# Altium project Time4CM4_Modular_v2.PrjPcb (part 2 of 2)
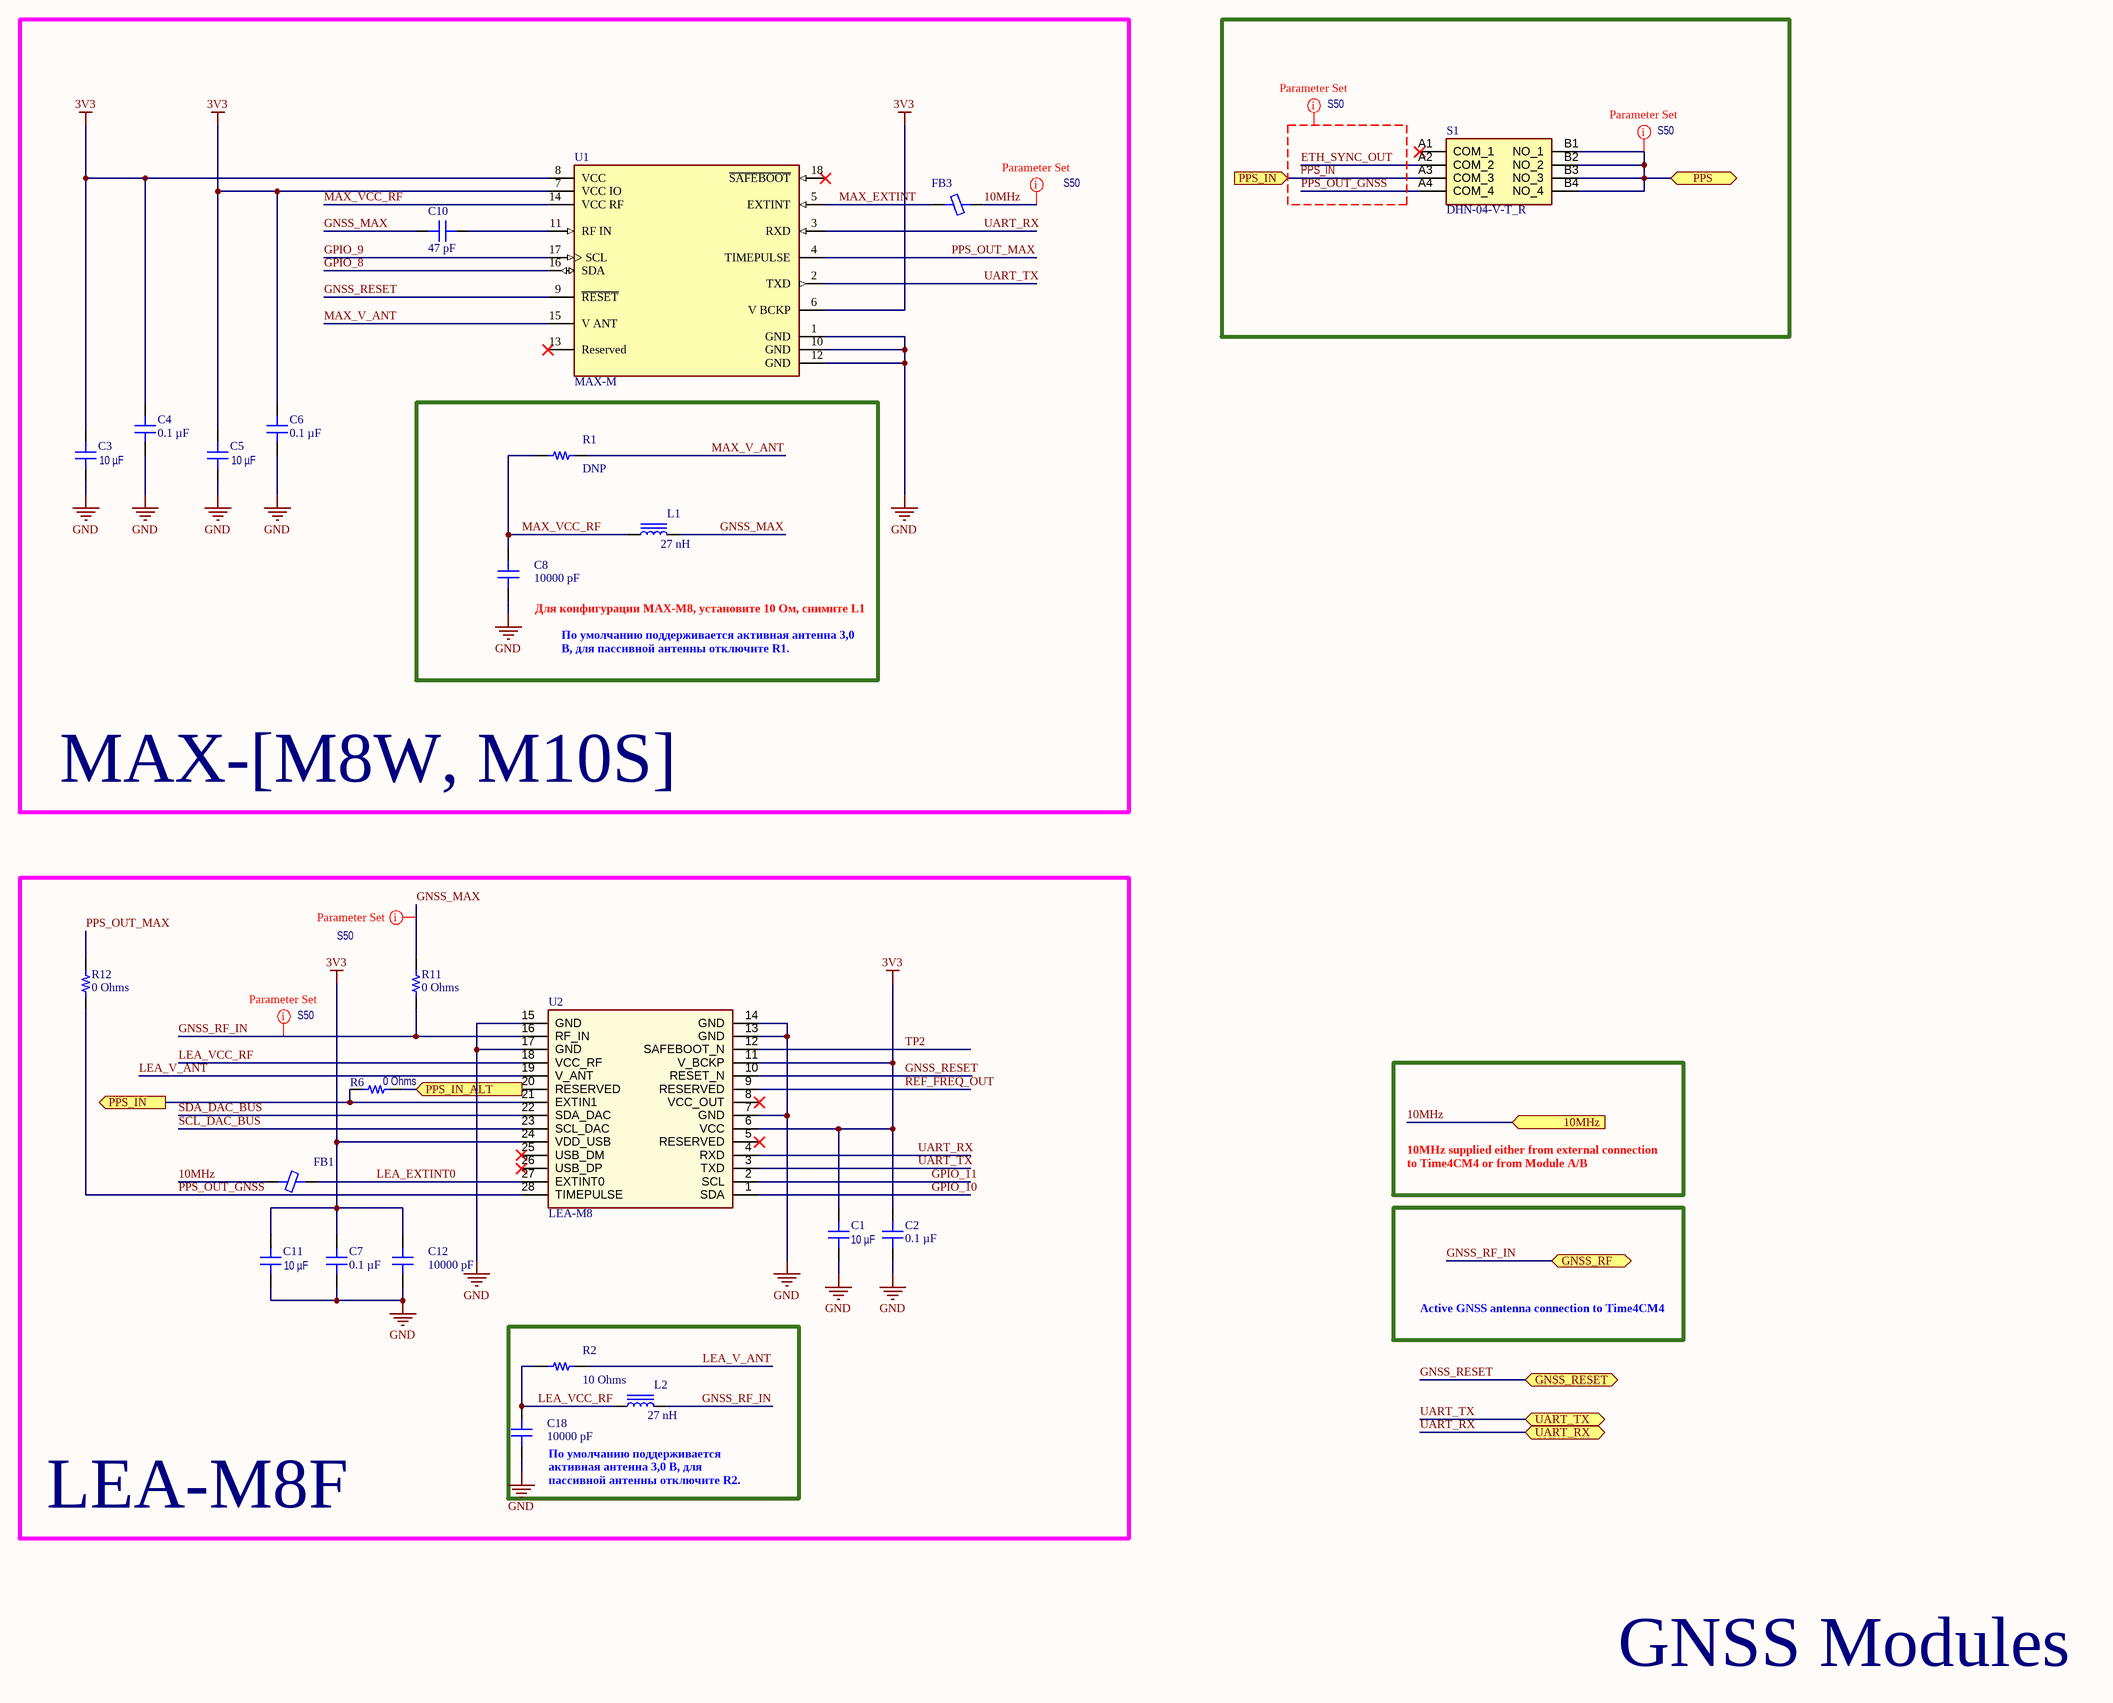
[diagram p6: GNSS.SchDoc]

## Nets that join several sheets
1V8: CM4_Conn (CM4.88 CM4.90), CM4_IO_Conn (CM1.88 CM1.90)
3V3: CM4_Conn (CM4.84 CM4.86), CM4_IO_Conn (CM1.84 CM1.86), Modular_BO (6 pins), GNSS (15 pins)
5V: CM4_Conn (6 pins), CM4_IO_Conn (6 pins), Modular_BO (C14.2 IC2.4 IC2.6)
GND: CM4_Conn (50 pins), CM4_IO_Conn (50 pins), Modular_BO (24 pins), GNSS (19 pins)
10MHz: Modular_BO (J2.1 J4.1 R10.1), GNSS (FB1.1 FB3.1)
ANAIP_0: CM4_Conn (CM4.96), CM4_IO_Conn (CM1.96)
ANAIP_1: CM4_Conn (CM4.94), CM4_IO_Conn (CM1.94)
BT_DIS: CM4_Conn (CM4.91), CM4_IO_Conn (CM1.91)
CM0_C_N: CM4_Conn (CM4.140), CM4_IO_Conn (CM1.140)
CM0_C_P: CM4_Conn (CM4.142), CM4_IO_Conn (CM1.142)
CM0_D0_N: CM4_Conn (CM4.128), CM4_IO_Conn (CM1.128)
CM0_D0_P: CM4_Conn (CM4.130), CM4_IO_Conn (CM1.130)
CM0_D1_N: CM4_Conn (CM4.134), CM4_IO_Conn (CM1.134)
CM0_D1_P: CM4_Conn (CM4.136), CM4_IO_Conn (CM1.136)
CM1_C_N: CM4_Conn (CM4.127), CM4_IO_Conn (CM1.127)
CM1_C_P: CM4_Conn (CM4.129), CM4_IO_Conn (CM1.129)
CM1_D0_N: CM4_Conn (CM4.115), CM4_IO_Conn (CM1.115)
CM1_D0_P: CM4_Conn (CM4.117), CM4_IO_Conn (CM1.117)
CM1_D1_N: CM4_Conn (CM4.121), CM4_IO_Conn (CM1.121)
CM1_D1_P: CM4_Conn (CM4.123), CM4_IO_Conn (CM1.123)
CM1_D2_N: CM4_Conn (CM4.133), CM4_IO_Conn (CM1.133)
CM1_D2_P: CM4_Conn (CM4.135), CM4_IO_Conn (CM1.135)
CM1_D3_N: CM4_Conn (CM4.139), CM4_IO_Conn (CM1.139)
CM1_D3_P: CM4_Conn (CM4.141), CM4_IO_Conn (CM1.141)
CM_GPIOx: CM4_Conn (CM4.97), CM4_IO_Conn (CM1.97)
DSI0_C_N: CM4_Conn (CM4.169), CM4_IO_Conn (CM1.169)
DSI0_C_P: CM4_Conn (CM4.171), CM4_IO_Conn (CM1.171)
DSI0_D0_N: CM4_Conn (CM4.157), CM4_IO_Conn (CM1.157)
DSI0_D0_P: CM4_Conn (CM4.159), CM4_IO_Conn (CM1.159)
DSI0_D1_N: CM4_Conn (CM4.163), CM4_IO_Conn (CM1.163)
DSI0_D1_P: CM4_Conn (CM4.165), CM4_IO_Conn (CM1.165)
DSI1_C_N: CM4_Conn (CM4.187), CM4_IO_Conn (CM1.187)
DSI1_C_P: CM4_Conn (CM4.189), CM4_IO_Conn (CM1.189)
DSI1_D0_N: CM4_Conn (CM4.175), CM4_IO_Conn (CM1.175)
DSI1_D0_P: CM4_Conn (CM4.177), CM4_IO_Conn (CM1.177)
DSI1_D1_N: CM4_Conn (CM4.181), CM4_IO_Conn (CM1.181)
DSI1_D1_P: CM4_Conn (CM4.183), CM4_IO_Conn (CM1.183)
DSI1_D2_N: CM4_Conn (CM4.193), CM4_IO_Conn (CM1.193)
DSI1_D2_P: CM4_Conn (CM4.195), CM4_IO_Conn (CM1.195)
DSI1_D3_N: CM4_Conn (CM4.194), CM4_IO_Conn (CM1.194)
DSI1_D3_P: CM4_Conn (CM4.196), CM4_IO_Conn (CM1.196)
EEPROM_WP: CM4_Conn (CM4.20), CM4_IO_Conn (CM1.20)
ETH_LED1: CM4_Conn (CM4.19), CM4_IO_Conn (CM1.19)
ETH_LED2: CM4_Conn (CM4.17), CM4_IO_Conn (CM1.17)
ETH_LED3: CM4_Conn (CM4.15), CM4_IO_Conn (CM1.15)
ETH_PAIR0_N: CM4_Conn (CM4.10), CM4_IO_Conn (CM1.10)
ETH_PAIR0_P: CM4_Conn (CM4.12), CM4_IO_Conn (CM1.12)
ETH_PAIR1_N: CM4_Conn (CM4.6), CM4_IO_Conn (CM1.6)
ETH_PAIR1_P: CM4_Conn (CM4.4), CM4_IO_Conn (CM1.4)
ETH_PAIR2_N: CM4_Conn (CM4.9), CM4_IO_Conn (CM1.9)
ETH_PAIR2_P: CM4_Conn (CM4.11), CM4_IO_Conn (CM1.11)
ETH_PAIR3_N: CM4_Conn (CM4.5), CM4_IO_Conn (CM1.5)
ETH_PAIR3_P: CM4_Conn (CM4.3), CM4_IO_Conn (CM1.3)
ETH_SYNC_IN: CM4_Conn (CM4.16), CM4_IO_Conn (CM1.16)
ETH_SYNC_OUT: CM4_Conn (CM4.18), CM4_IO_Conn (CM1.18), GNSS (S1.A2)
GLOBAL_EN: CM4_Conn (CM4.99), CM4_IO_Conn (CM1.99)
GNSS_RESET: CM4_Conn (CM4.25), CM4_IO_Conn (CM1.25), GNSS (U1.9 U2.10)
GNSS_RF_IN: Modular_BO (J1.1), GNSS (L2.2 R11.1 U2.16)
GPIO_0: CM4_Conn (CM4.36), CM4_IO_Conn (CM1.36), Modular_BO (Y1.2 Y2.2)
GPIO_1: CM4_Conn (CM4.35), CM4_IO_Conn (CM1.35), Modular_BO (Y1.3 Y2.3)
GPIO_2: CM4_Conn (CM4.58), CM4_IO_Conn (CM1.58)
GPIO_3: CM4_Conn (CM4.56), CM4_IO_Conn (CM1.56)
GPIO_4: CM4_Conn (CM4.54), CM4_IO_Conn (CM1.54)
GPIO_5: CM4_Conn (CM4.34), CM4_IO_Conn (CM1.34)
GPIO_6: CM4_Conn (CM4.30), CM4_IO_Conn (CM1.30)
GPIO_7: CM4_Conn (CM4.37), CM4_IO_Conn (CM1.37)
GPIO_8: CM4_Conn (CM4.39), CM4_IO_Conn (CM1.39), GNSS (U1.16)
GPIO_9: CM4_Conn (CM4.40), CM4_IO_Conn (CM1.40), GNSS (U1.17)
GPIO_10: CM4_Conn (CM4.44), CM4_IO_Conn (CM1.44), GNSS (U2.1)
GPIO_11: CM4_Conn (CM4.38), CM4_IO_Conn (CM1.38), GNSS (U2.2)
GPIO_12: CM4_Conn (CM4.31), CM4_IO_Conn (CM1.31)
GPIO_13: CM4_Conn (CM4.28), CM4_IO_Conn (CM1.28)
GPIO_16: CM4_Conn (CM4.29), CM4_IO_Conn (CM1.29)
GPIO_17: CM4_Conn (CM4.50), CM4_IO_Conn (CM1.50)
GPIO_18: CM4_Conn (CM4.49), CM4_IO_Conn (CM1.49)
GPIO_19: CM4_Conn (CM4.26), CM4_IO_Conn (CM1.26)
GPIO_20: CM4_Conn (CM4.27), CM4_IO_Conn (CM1.27)
GPIO_22: CM4_Conn (CM4.46), CM4_IO_Conn (CM1.46)
GPIO_23: CM4_Conn (CM4.47), CM4_IO_Conn (CM1.47)
GPIO_24: CM4_Conn (CM4.45), CM4_IO_Conn (CM1.45)
GPIO_25: CM4_Conn (CM4.41), CM4_IO_Conn (CM1.41)
GPIO_26: CM4_Conn (CM4.24), CM4_IO_Conn (CM1.24)
GPIO_27: CM4_Conn (CM4.48), CM4_IO_Conn (CM1.48)
GPIO_44: CM4_Conn (CM4.82), CM4_IO_Conn (CM1.82)
GPIO_45: CM4_Conn (CM4.80), CM4_IO_Conn (CM1.80)
GPIO_VREF: CM4_Conn (CM4.78), CM4_IO_Conn (CM1.78)
HDMI0_CEC: CM4_Conn (CM4.151), CM4_IO_Conn (CM1.151)
HDMI0_CLK_N: CM4_Conn (CM4.190), CM4_IO_Conn (CM1.190)
HDMI0_CLK_P: CM4_Conn (CM4.188), CM4_IO_Conn (CM1.188)
HDMI0_HP: CM4_Conn (CM4.153), CM4_IO_Conn (CM1.153)
HDMI0_SCL: CM4_Conn (CM4.200), CM4_IO_Conn (CM1.200)
HDMI0_SDA: CM4_Conn (CM4.199), CM4_IO_Conn (CM1.199)
HDMI0_TX0_N: CM4_Conn (CM4.184), CM4_IO_Conn (CM1.184)
HDMI0_TX0_P: CM4_Conn (CM4.182), CM4_IO_Conn (CM1.182)
HDMI0_TX1_N: CM4_Conn (CM4.178), CM4_IO_Conn (CM1.178)
HDMI0_TX1_P: CM4_Conn (CM4.176), CM4_IO_Conn (CM1.176)
HDMI0_TX2_N: CM4_Conn (CM4.172), CM4_IO_Conn (CM1.172)
HDMI0_TX2_P: CM4_Conn (CM4.170), CM4_IO_Conn (CM1.170)
HDMI1_CEC: CM4_Conn (CM4.149), CM4_IO_Conn (CM1.149)
HDMI1_CLK_N: CM4_Conn (CM4.166), CM4_IO_Conn (CM1.166)
HDMI1_CLK_P: CM4_Conn (CM4.164), CM4_IO_Conn (CM1.164)
HDMI1_HP: CM4_Conn (CM4.143), CM4_IO_Conn (CM1.143)
HDMI1_SCL: CM4_Conn (CM4.147), CM4_IO_Conn (CM1.147)
HDMI1_SDA: CM4_Conn (CM4.145), CM4_IO_Conn (CM1.145)
HDMI1_TX0_N: CM4_Conn (CM4.160), CM4_IO_Conn (CM1.160)
HDMI1_TX0_P: CM4_Conn (CM4.158), CM4_IO_Conn (CM1.158)
HDMI1_TX1_N: CM4_Conn (CM4.154), CM4_IO_Conn (CM1.154)
HDMI1_TX1_P: CM4_Conn (CM4.152), CM4_IO_Conn (CM1.152)
HDMI1_TX2_N: CM4_Conn (CM4.148), CM4_IO_Conn (CM1.148)
HDMI1_TX2_P: CM4_Conn (CM4.146), CM4_IO_Conn (CM1.146)
LED_ACT: CM4_Conn (CM4.21), CM4_IO_Conn (CM1.21)
LED_PWR: CM4_Conn (CM4.95), CM4_IO_Conn (CM1.95)
nEXTRST: CM4_Conn (CM4.100), CM4_IO_Conn (CM1.100)
nRPIBOOT: CM4_Conn (CM4.93), CM4_IO_Conn (CM1.93)
PCIe_CLK_N: CM4_Conn (CM4.112), CM4_IO_Conn (CM1.112)
PCIe_CLK_nREQ: CM4_Conn (CM4.102), CM4_IO_Conn (CM1.102)
PCIe_CLK_P: CM4_Conn (CM4.110), CM4_IO_Conn (CM1.110)
PCIe_nRST: CM4_Conn (CM4.109), CM4_IO_Conn (CM1.109)
PCIe_RX_N: CM4_Conn (CM4.118), CM4_IO_Conn (CM1.118)
PCIe_RX_P: CM4_Conn (CM4.116), CM4_IO_Conn (CM1.116)
PCIe_TX_N: CM4_Conn (CM4.124), CM4_IO_Conn (CM1.124)
PCIe_TX_P: CM4_Conn (CM4.122), CM4_IO_Conn (CM1.122)
PPS: Modular_BO (IC1.6 J2.8), GNSS (S1.B1 S1.B2 S1.B3 S1.B4)
PPS_IN: Modular_BO (IC1.7 J2.4), GNSS (R6.1 S1.A3 U2.21)
REF_FREQ_OUT: Modular_BO (J2.9), GNSS (U2.9)
RUN_PG: CM4_Conn (CM4.92), CM4_IO_Conn (CM1.92)
SCL_DAC_BUS: Modular_BO (J2.5), GNSS (U2.23)
SD_CLK: CM4_Conn (CM4.57), CM4_IO_Conn (CM1.57)
SD_CMD: CM4_Conn (CM4.62), CM4_IO_Conn (CM1.62)
SD_DAT0: CM4_Conn (CM4.63), CM4_IO_Conn (CM1.63)
SD_DAT1: CM4_Conn (CM4.67), CM4_IO_Conn (CM1.67)
SD_DAT2: CM4_Conn (CM4.69), CM4_IO_Conn (CM1.69)
SD_DAT3: CM4_Conn (CM4.61), CM4_IO_Conn (CM1.61)
SD_DAT4: CM4_Conn (CM4.68), CM4_IO_Conn (CM1.68)
SD_DAT5: CM4_Conn (CM4.64), CM4_IO_Conn (CM1.64)
SD_DAT6: CM4_Conn (CM4.72), CM4_IO_Conn (CM1.72)
SD_DAT7: CM4_Conn (CM4.70), CM4_IO_Conn (CM1.70)
SD_PWR_ON: CM4_Conn (CM4.75), CM4_IO_Conn (CM1.75)
SD_VDD_OR: CM4_Conn (CM4.73), CM4_IO_Conn (CM1.73)
SDA_DAC_BUS: Modular_BO (J2.3), GNSS (U2.22)
TP2: Modular_BO (J2.7), GNSS (U2.12)
UART_RX: CM4_Conn (CM4.55), CM4_IO_Conn (CM1.55), GNSS (U1.3 U2.4)
UART_TX: CM4_Conn (CM4.51), CM4_IO_Conn (CM1.51), GNSS (U1.2 U2.3)
USB_N: CM4_Conn (CM4.103), CM4_IO_Conn (CM1.103)
USB_OTG: CM4_Conn (CM4.101), CM4_IO_Conn (CM1.101)
USB_P: CM4_Conn (CM4.105), CM4_IO_Conn (CM1.105)
VDAC_COMP: CM4_Conn (CM4.111), CM4_IO_Conn (CM1.111)
WL_DIS: CM4_Conn (CM4.89), CM4_IO_Conn (CM1.89)

## Assembly variants
M8F: not fitted C5 C6 C8 C10 C17 FB3 L1 R1 R11 R12 U1 Y1